# EAGLE design pico8enc (EAGLE 9.6.2)
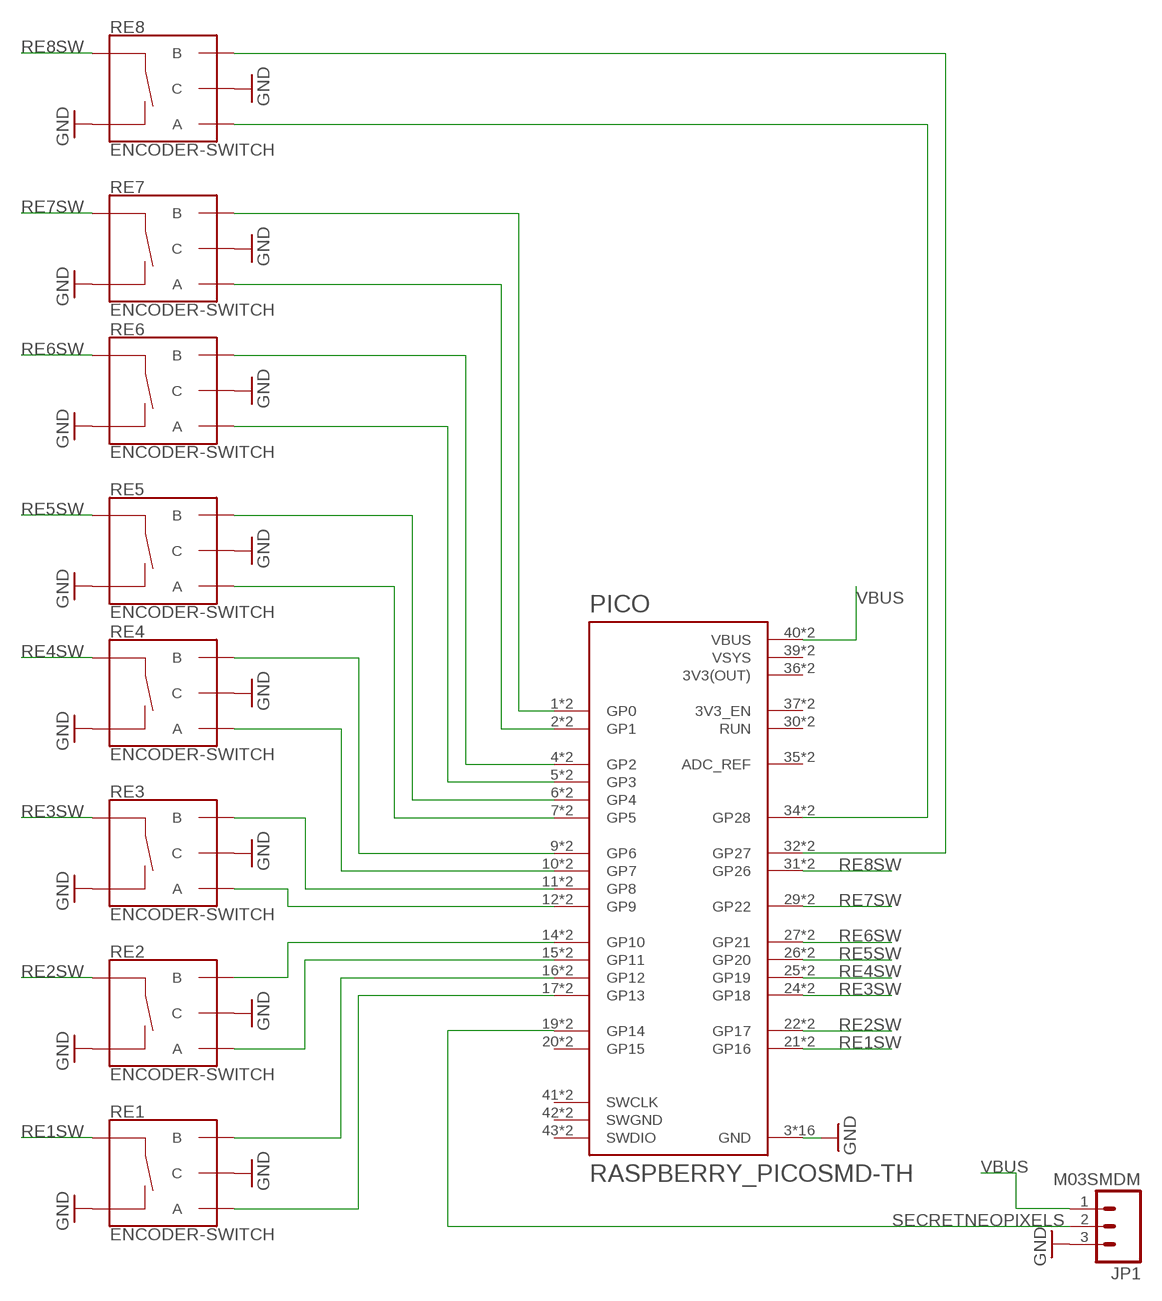
[diagram p0: schematic, sheet 1]

## Parts
JP1  M03SMDM  [1X03-SMD-MINIMAL]
PICO  RASPBERRY_PICOSMD-TH  [PICO-PKG]
RE1  ENCODER-SWITCH  [ROTARY_ENC_PLAIN]
RE2  ENCODER-SWITCH  [ROTARY_ENC_PLAIN]
RE3  ENCODER-SWITCH  [ROTARY_ENC_PLAIN]
RE4  ENCODER-SWITCH  [ROTARY_ENC_PLAIN]
RE5  ENCODER-SWITCH  [ROTARY_ENC_PLAIN]
RE6  ENCODER-SWITCH  [ROTARY_ENC_PLAIN]
RE7  ENCODER-SWITCH  [ROTARY_ENC_PLAIN]
RE8  ENCODER-SWITCH  [ROTARY_ENC_PLAIN]

## Nets
GND: JP1.3 PICO.3(GND) PICO.8(GND) PICO.13(GND) PICO.18(GND) PICO.23(GND) PICO.28(GND) PICO.33(GND) PICO.38(GND) PICO.P$3(GND) PICO.P$8(GND) PICO.P$13(GND) PICO.P$18(GND) PICO.P$23(GND) PICO.P$28(GND) PICO.P$33(GND) PICO.P$38(GND) RE1.C RE1.SW- RE2.C RE2.SW- RE3.C RE3.SW- RE4.C RE4.SW- RE5.C RE5.SW- RE6.C RE6.SW- RE7.C RE7.SW- RE8.C RE8.SW-
N$1: PICO.17(GP13) PICO.P$17(GP13) RE1.A
N$2: PICO.16(GP12) PICO.P$16(GP12) RE1.B
N$3: PICO.15(GP11) PICO.P$15(GP11) RE2.A
N$4: PICO.14(GP10) PICO.P$14(GP10) RE2.B
N$5: PICO.12(GP9) PICO.P$12(GP9) RE3.A
N$6: PICO.11(GP8) PICO.P$11(GP8) RE3.B
N$7: PICO.10(GP7) PICO.P$10(GP7) RE4.A
N$8: PICO.9(GP6) PICO.P$9(GP6) RE4.B
N$9: PICO.7(GP5) PICO.P$7(GP5) RE5.A
N$10: PICO.6(GP4) PICO.P$6(GP4) RE5.B
N$11: PICO.5(GP3) PICO.P$5(GP3) RE6.A
N$12: PICO.4(GP2) PICO.P$4(GP2) RE6.B
N$13: PICO.2(GP1) PICO.P$2(GP1) RE7.A
N$14: PICO.1(GP0) PICO.P$1(GP0) RE7.B
N$15: PICO.34(GP28) PICO.P$34(GP28) RE8.A
N$16: PICO.32(GP27) PICO.P$32(GP27) RE8.B
RE1SW: PICO.21(GP16) PICO.P$21(GP16) RE1.SW+
RE2SW: PICO.22(GP17) PICO.P$22(GP17) RE2.SW+
RE3SW: PICO.24(GP18) PICO.P$24(GP18) RE3.SW+
RE4SW: PICO.25(GP19) PICO.P$25(GP19) RE4.SW+
RE5SW: PICO.26(GP20) PICO.P$26(GP20) RE5.SW+
RE6SW: PICO.27(GP21) PICO.P$27(GP21) RE6.SW+
RE7SW: PICO.29(GP22) PICO.P$29(GP22) RE7.SW+
RE8SW: PICO.31(GP26) PICO.P$31(GP26) RE8.SW+
SECRETNEOPIXELS: JP1.2 PICO.19(GP14) PICO.P$19(GP14)
VBUS: JP1.1 PICO.40(VBUS) PICO.P$40(VBUS)
Unconnected: PICO.20(GP15) PICO.30(RUN) PICO.35(ADC_REF) PICO.37(3V3_EN) PICO.41(SWCLK) PICO.43(SWDIO) PICO.P$20(GP15) PICO.P$30(RUN) PICO.P$35(ADC_REF) PICO.P$37(3V3_EN) PICO.P$41(SWCLK) PICO.P$43(SWDIO)

## Power pins joined to a net without a drawn wire
3V3(OUT): PICO.36(3V3(OUT)) PICO.P$36(3V3(OUT))
SWGND: PICO.42(SWGND) PICO.P$42(SWGND)
VSYS: PICO.39(VSYS) PICO.P$39(VSYS)

## Library data of the parts
JP1 = todstuff:M03
PICO = RpiPico:RASPBERRY_PICO: Raspberry Pi Pico
RE1-RE8 = SparkFun-Switches:ENCODER-SWITCH: Rotary Encoder w/ Select Switch Encoders rotate similarly to potentiometers, but they’re different from potentiometers in that an encoder has full rotation without limits. They output gray code so that you can tell how much and in which direction the encoder has been turned. This encoder includes a push-down select switch built into the shaft. SparkFun Products Rotary Encoder <https://www.sparkfun.com/products/9117> (COM-09117); SF_SKU: COM-09117

## Board
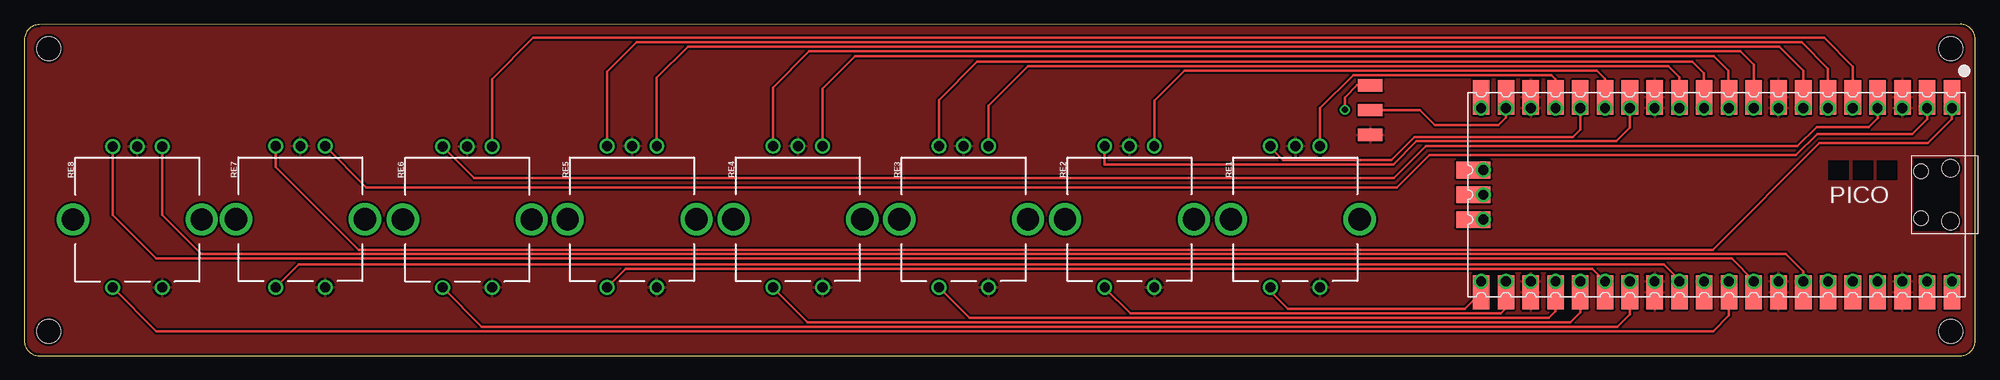
[diagram p1: board, top side]
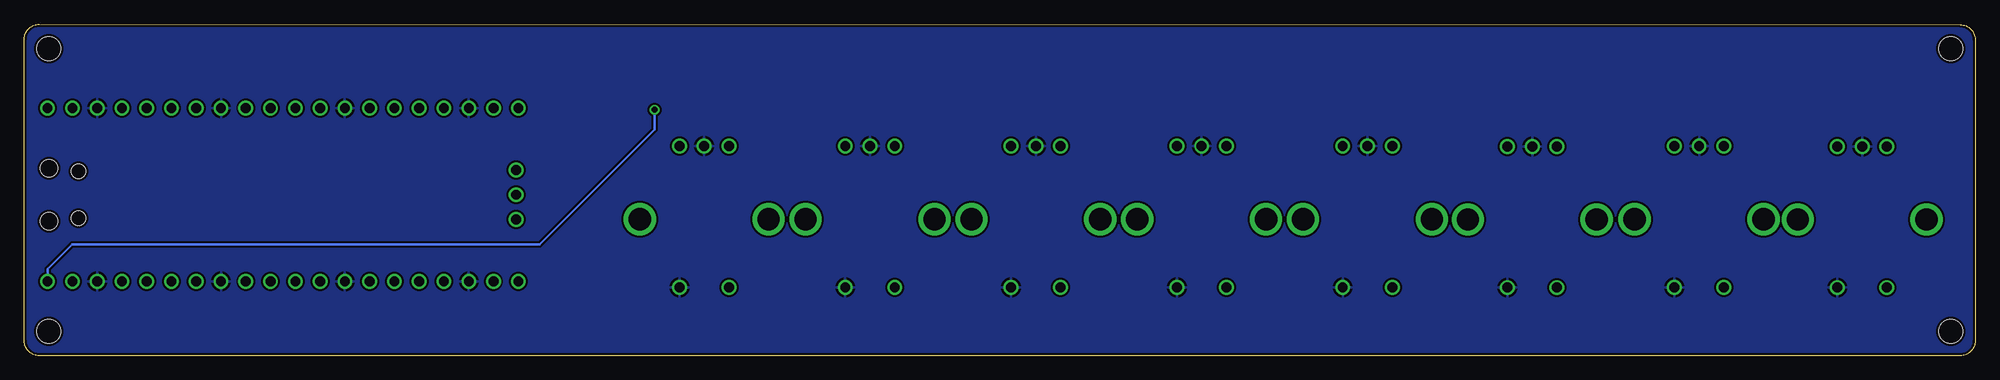
[diagram p2: board, bottom side, seen from below]

Size 200 x 34 mm. Coordinates in mm from the lower left corner, seen from the top.
Outline: 198.5,34 1.5,33.96 arc90 0,32.46 0,1.5 arc90 1.5,0 198.5,0 arc90 200,1.5 200,32.5 arc90 198.5,34
Copper layers (1*16): Top 0.035mm / dielectric 1.5mm / Bottom 0.035mm
Design rules "adafruit-rules-20180530 *": minimum track width 10mil, minimum drill 16mil, track to track 8mil, track to pad 8mil, pad to pad 8mil, via to via 8mil, smd to smd 8mil, copper to edge 10mil, drill to drill 8mil, minimum pad ring 10mil, minimum via ring 8mil, stop-mask expansion 4mil, vias tented up to drill 20mil, thermal gap 10mil
Holes 2.5 mm at 2.5,31.5 2.5,2.5 197.5,31.5 197.5,2.5

### Footprints (pad centres in the part's own frame; a part is rotated, then mirrored left to right if it is on the bottom)
1X03-SMD-MINIMAL = smd 1.27 x 2.5: 1 -2.54,-0.01; 2 0,-0.01; 3 2.54,-0.01
PICO-PKG = drill 1: 1 -8.89,24.13; 2 -8.89,21.59; 3 -8.89,19.05; 4 -8.89,16.51; 5 -8.89,13.97; 6 -8.89,11.43; 7 -8.89,8.89; 8 -8.89,6.35; 9 -8.89,3.81; 10 -8.89,1.27; 11 -8.89,-1.27; 12 -8.89,-3.81; 13 -8.89,-6.35; 14 -8.89,-8.89; 15 -8.89,-11.43; 16 -8.89,-13.97; 17 -8.89,-16.51; 18 -8.89,-19.05; 19 -8.89,-21.59; 20 -8.89,-24.13; 21 8.89,-24.13; 22 8.89,-21.59; 23 8.89,-19.05; 24 8.89,-16.51; 25 8.89,-13.97; 26 8.89,-11.43; 27 8.89,-8.89; 28 8.89,-6.35; 29 8.89,-3.81; 30 8.89,-1.27; 31 8.89,1.27; 32 8.89,3.81; 33 8.89,6.35; 34 8.89,8.89; 35 8.89,11.43; 36 8.89,13.97; 37 8.89,16.51; 38 8.89,19.05; 39 8.89,21.59; 40 8.89,24.13; 41 -2.54,-23.9; 42 0,-23.9; 43 2.54,-23.9 | smd 3.5 x 1.7: P$1 -10,24.13; P$2 -10,21.59; P$3 -10,19.05; P$4 -10,16.51; P$5 -10,13.97; P$6 -10,11.43; P$7 -10,8.89; P$8 -10,6.35; P$9 -10,3.81; P$10 -10,1.27; P$11 -10,-1.27; P$12 -10,-3.81; P$13 -10,-6.35; P$14 -10,-8.89; P$15 -10,-11.43; P$16 -10,-13.97; P$17 -10,-16.51; P$18 -10,-19.05; P$19 -10,-21.59; P$20 -10,-24.13; P$21 10,-24.13; P$22 10,-21.59; P$23 10,-19.05; P$24 10,-16.51; P$25 10,-13.97; P$26 10,-11.43; P$27 10,-8.89; P$28 10,-6.35; P$29 10,-3.81; P$30 10,-1.27; P$31 10,1.27; P$32 10,3.81; P$33 10,6.35; P$34 10,8.89; P$35 10,11.43; P$36 10,13.97; P$37 10,16.51; P$38 10,19.05; P$39 10,21.59; P$40 10,24.13 | smd 1.7 x 3.5: P$41 -2.54,-24.925; P$42 0,-24.925; P$43 2.54,-24.925 | hole 1.8: -2.725,24; 2.725,24 | hole 1.5: -2.425,20.97; 2.425,20.97
ROTARY_ENC_PLAIN = drill 1.016: A 7.493,-2.54; B 7.493,2.54; C 7.493,0; SW+ -6.985,2.54; SW- -6.985,-2.54 | drill 2.286: P$3 0,6.604; P$4 0,-6.604

### Placement (x,y rotation side)
JP1  138,25.2 270 top
PICO  173.49,16.51 270 top
RE1  130.3,14 90 top
RE2  113.3,14 90 top
RE3  96.3,14 90 top
RE4  79.3,14 90 top
RE5  62.3,14 90 top
RE6  45.41,13.97 90 top
RE7  28.3,14 90 top
RE8  11.58,13.97 90 top

### Tracks (layer width: path | path; a pad name or v marks a point on that pad's centre or on a via)
3V3(OUT)
  Top 0.254: PICO.P$36 PICO.36
GND
  pour Top: 0,35.56 200.16,35.56 200.16,-3.81 0,-3.81
  pour Bottom: -1.27,38.1 201.43,38.1 201.43,-2.54 -1.27,-2.54
N$1
  Top 0.254: RE1.A 132.84,25.39 136.25,28.8 156.55,28.8 156.98,28.37 PICO.P$17 PICO.17
N$2
  Top 0.254: RE1.B 127.76,21.37 129.04,20.09 140.14,20.09 142.5,22.45 158.76,22.45 159.52,23.22 PICO.P$16 PICO.16
N$3
  Top 0.254: RE2.A 115.84,26.17 118.93,29.26 161.22,29.26 162.06,28.42 PICO.P$15 PICO.15
N$4
  Top 0.254: RE2.B 110.76,19.63 140.37,19.63 142.73,22 163.2,22 164.6,23.39 PICO.P$14 PICO.14
N$5
  Top 0.254: PICO.12 PICO.P$12 169.68,28.6 168.56,29.72 102.88,29.72 98.84,25.68 RE3.A
N$6
  Top 0.254: RE3.B 93.76,26.25 97.69,30.18 171,30.18 172.19,28.98 172.19,26.54 PICO.P$11 PICO.11
N$7
  Top 0.254: RE4.A 81.84,27.4 85.17,30.73 173.21,30.73 174.71,29.23 174.71,26.56 PICO.P$10 PICO.10
N$8
  Top 0.254: PICO.9 PICO.P$9 177.3,29.84 175.9,31.24 80.47,31.24 76.76,27.53 RE4.B
N$9
  Top 0.254: RE5.A 64.84,28.51 68.03,31.7 179.92,31.7 182.38,29.23 PICO.P$7 PICO.7
N$10
  Top 0.254: RE5.B 59.76,29.14 62.78,32.16 182.23,32.16 184.92,29.46 PICO.P$6 PICO.6
N$11
  Top 0.254: RE6.A 47.95,28.4 52.16,32.61 184.51,32.61 187.46,29.67 PICO.P$5 PICO.5
N$12
  Top 0.254: RE6.B 46.12,18.21 140.39,18.21 143.68,21.5 181.78,21.5 183.75,23.47 189.11,23.47 190,24.36 PICO.P$4 PICO.4
N$13
  Top 0.254: RE7.A 35.06,17.27 140.72,17.27 144.03,20.57 181.62,20.57 183.8,22.76 193.58,22.76 195.08,24.26 PICO.P$2 PICO.2
N$14
  Top 0.254: RE7.B 25.76,19.37 34.26,10.87 173.11,10.87 184.03,21.79 195.13,21.79 197.62,24.28 PICO.P$1 PICO.1
N$15
  Top 0.254: RE8.A 14.12,14.41 18.12,10.41 180.6,10.41 182.39,8.63 PICO.34 PICO.P$34
N$16
  Top 0.254: RE8.B 9.04,14.46 13.54,9.96 175.04,9.96 177.3,7.7 PICO.32 PICO.P$32
RE1SW
  Top 0.254: RE1.SW+ 127.76,6.61 129.54,4.83 147.68,4.83 PICO.P$21 PICO.21
RE2SW
  Top 0.254: RE2.SW+ 110.76,6.97 113.39,4.34 151.37,4.34 151.9,4.88 PICO.P$22 151.9,7.61 PICO.22
RE3SW
  Top 0.254: RE3.SW+ 96.89,3.89 156.32,3.89 156.98,4.55 PICO.P$24 PICO.24
RE4SW
  Top 0.254: RE4.SW+ 76.76,6.97 80.3,3.43 158.5,3.43 159.52,4.45 PICO.P$25 PICO.25
RE5SW
  Top 0.254: RE5.SW+ 61.66,8.91 160.76,8.91 PICO.26 PICO.P$26
RE6SW
  Top 0.254: RE6.SW+ 46.88,2.97 163.33,2.97 164.6,4.24 PICO.P$27 PICO.27
RE7SW
  Top 0.254: PICO.P$29 PICO.29 169.68,7.77 168.08,9.37 28.12,9.37 RE7.SW+
RE8SW
  Top 0.254: RE8.SW+ 13.54,2.49 173.13,2.49 174.76,4.12 PICO.P$31 PICO.31
SECRETNEOPIXELS
  Top 0.254: PICO.P$19 PICO.19 151.9,24.43 151.14,23.67 144.61,23.67 143.08,25.2 JP1.2
SWGND
  Top 0.254: PICO.P$42 PICO.42
VBUS  (via drill 0.6)
  Top 0.254: PICO.P$40 PICO.40 | v135.4,25.23 135.4,26.5 136.64,27.74 JP1.1
  Bottom 0.254: v135.4,25.23 135.4,23.21 147.18,11.43 195.08,11.43 197.62,8.89 PICO.40
VSYS
  Top 0.254: PICO.P$39 PICO.39